# Altium schematic sheet INTERFACE.SchDoc
size A4
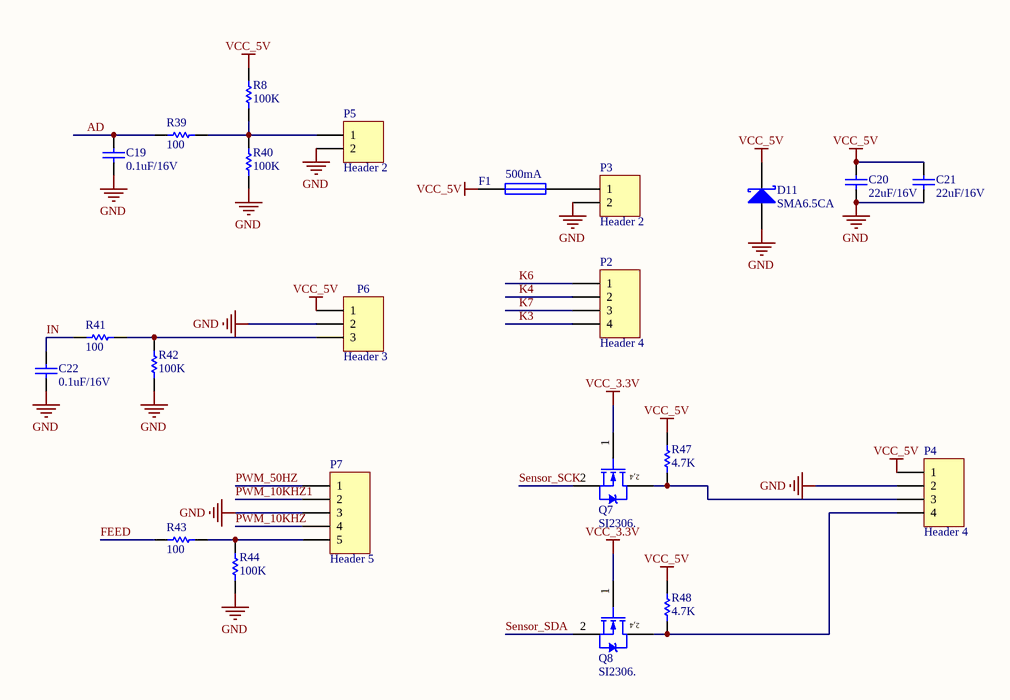
[diagram p0: INTERFACE.SchDoc]

## Parts
C19  0.1uF/16V  [0603C]
C20  22uF/16V  [0805C]
C21  22uF/16V  [0805C]
C22  0.1uF/16V  [0603C]
D11  SMA6.5CA  [SMA]
F1  500mA  [0805R]
P2  Header 4  [4-2.5MM-W]
P3  Header 2  [2-2.5MM-W]
P4  Header 4  [4-2.5MM-W]
P5  Header 2  [2-2.5MM-W]
P6  Header 3  [3-2.5MM-W]
P7  Header 5  [5-2.5MM-W]
Q7  SI2306.  [SOT23-3]
Q8  SI2306.  [SOT23-3]
R8  100K  [0603R]
R39  100  [0603R]
R40  100K  [0603R]
R41  100  [0603R]
R42  100K  [0603R]
R43  100  [0603R]
R44  100K  [0603R]
R47  4.7K  [0603R]
R48  4.7K  [0603R]

## Nets
GND: C19.2 C20.2 C21.2 C22.2 D11.1(A) P3.2 P4.2 P5.2 P6.2 P7.3 R40.2 R42.2 R44.2
VCC_3.3V: Q7.1(G) Q8.1(G)
VCC_5V: C20.1 C21.1 D11.2(K) F1.1 P4.1 P6.1 R8.1 R47.2 R48.2
AD: C19.1 R39.1
FEED: R43.1
IN: C22.1 R41.1
K3: P2.4
K4: P2.2
K6: P2.1
K7: P2.3
PWM_10KHZ: P7.4
PWM_10KHZ1: P7.2
PWM_50HZ: P7.1
Sensor_SCK: Q7.2(S)
Sensor_SDA: Q8.2(S)
NetF1_2: F1.2 P3.1
NetP4_3: P4.3 Q7.3(D) R47.1
NetP4_4: P4.4 Q8.3(D) R48.1
NetP5_1: P5.1 R8.2 R39.2 R40.1
NetP6_3: P6.3 R41.2 R42.1
NetP7_5: P7.5 R43.2 R44.1

## Notes on the sheet
- (in symbol BUK92150-55A) 2,4

## Library data of the parts
C19-C22 = Cap: Capacitor; Value: 2.2uF/6.3V; Published: 8-Jun-2000; LatestRevisionDate: 17-Jul-2002; LatestRevisionNote: Re-released for DXP Platform.; PackageReference: RAD-0.3; Publisher: Altium Limited
D11 = D Schottky: Schottky Diode; Published: 8-Jun-2000; LatestRevisionDate: 17-Jul-2002; LatestRevisionNote: Re-released for DXP Platform.; PackageReference: SMB; Publisher: Altium Limited; Code_JEDEC: DO-214-AA
F1 = Fuse 1: Fuse; Published: 8-Jun-2000; LatestRevisionDate: 17-Jul-2002; LatestRevisionNote: Re-released for DXP Platform.; PackageReference: PIN-W2/E2.8; Publisher: Altium Limited
P2 P4 = Header 4: Header, 4-Pin; LatestRevisionDate: 17-Jul-2002; LatestRevisionNote: Re-released for DXP Platform.; Publisher: Altium Limited
P3 P5 = Header 2: Header, 2-Pin; LatestRevisionDate: 17-Jul-2002; LatestRevisionNote: Re-released for DXP Platform.; Publisher: Altium Limited
P6 = Header 3: Header, 3-Pin; LatestRevisionDate: 17-Jul-2002; LatestRevisionNote: Re-released for DXP Platform.; Publisher: Altium Limited
P7 = Header 5: Header, 5-Pin; LatestRevisionDate: 17-Jul-2002; LatestRevisionNote: Re-released for DXP Platform.; Publisher: Altium Limited
Q7 Q8 = BUK92150-55A: Published: 8-Jun-2000; LatestRevisionDate: 17-Jul-2002; LatestRevisionNote: Re-released for DXP Platform.; DatasheetVersion: 6-Oct-1997; PackageVersion: Aug-1998; PackageReference: TSOP-6; Publisher: Altium Limited; PackageDescription: SOT-457/SC-74; 6 Leads; Body 3.1 x 3 mm, inc. leads (LxW max); ComponentLink1Description: Manufacturer Link; ComponentLink1URL: http://www.vishay.com/; ComponentLink2Description: Datasheet; ComponentLink2URL: http://www.vishay.com/docs/70192/70192.pdf
R8 R39-R44 R47 R48 = Res1: Resistor; Value: 1K; Published: 8-Jun-2000; LatestRevisionDate: 17-Jul-2002; LatestRevisionNote: Re-released for DXP Platform.; PackageReference: AXIAL-0.3; Publisher: Altium Limited